# Altium schematic sheet Z_Power.SchDoc
size A3
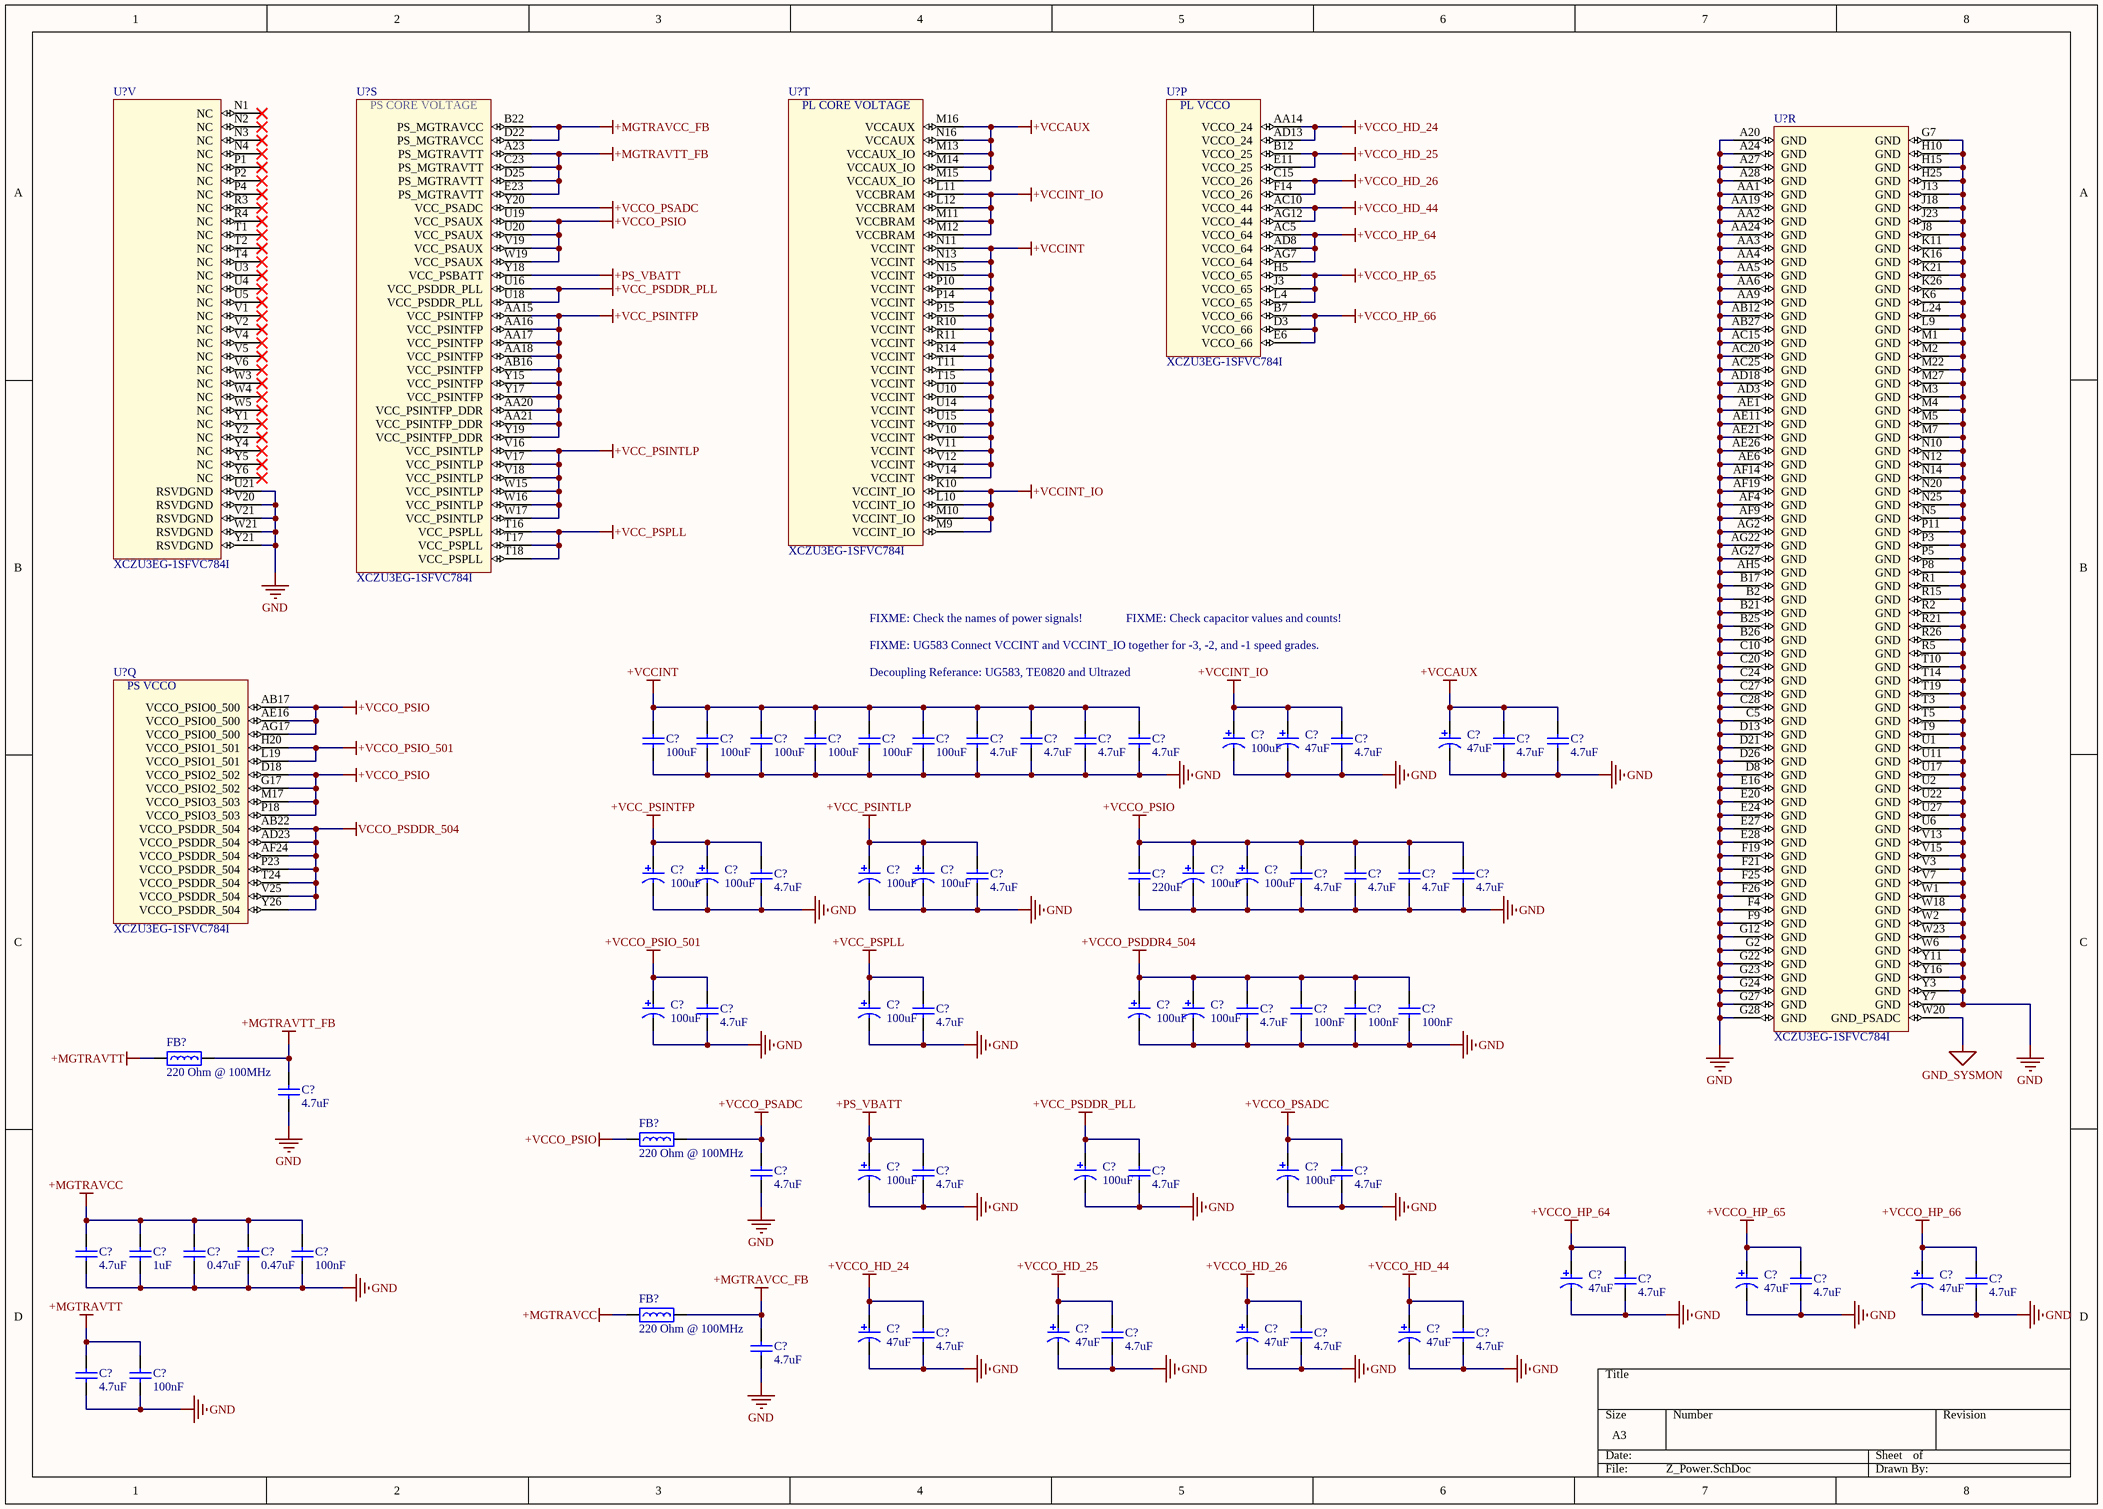
[diagram p0: Z_Power.SchDoc]

## Parts
(Parts that share a designator on the sheet are numbered #1, #2 ... from top to bottom, then left to right.)
C?#1  100uF  [AVX_TAN_F95_P_0905]
C?#2  47uF  [AVX_TAN_F38_M_0603]
C?#3  4.7uF  [CAPC1005L_0402]
C?#4  47uF  [AVX_TAN_F38_M_0603]
C?#5  4.7uF  [CAPC1005L_0402]
C?#6  4.7uF  [CAPC1005L_0402]
C?#7  100uF  [CAPC3225N_1210]
C?#8  100uF  [CAPC3225N_1210]
C?#9  100uF  [CAPC3225N_1210]
C?#10  100uF  [CAPC3225N_1210]
C?#11  100uF  [CAPC3225N_1210]
C?#12  100uF  [CAPC3225N_1210]
C?#13  4.7uF  [CAPC1005L_0402]
C?#14  4.7uF  [CAPC1005L_0402]
C?#15  4.7uF  [CAPC1005L_0402]
C?#16  4.7uF  [CAPC1005L_0402]
C?#17  100uF  [AVX_TAN_F95_P_0905]
C?#18  100uF  [AVX_TAN_F95_P_0905]
C?#19  4.7uF  [CAPC1005L_0402]
C?#20  100uF  [AVX_TAN_F95_P_0905]
C?#21  100uF  [AVX_TAN_F95_P_0905]
C?#22  4.7uF  [CAPC1005L_0402]
C?#23  100uF  [AVX_TAN_F95_P_0905]
C?#24  100uF  [AVX_TAN_F95_P_0905]
C?#25  4.7uF  [CAPC1005L_0402]
C?#26  4.7uF  [CAPC1005L_0402]
C?#27  4.7uF  [CAPC1005L_0402]
C?#28  4.7uF  [CAPC1005L_0402]
C?#29  220uF  [CAPC3225N_1210]
C?#30  100uF  [AVX_TAN_F95_P_0905]
C?#31  4.7uF  [CAPC1005L_0402]
C?#32  100uF  [AVX_TAN_F95_P_0905]
C?#33  4.7uF  [CAPC1005L_0402]
C?#34  100uF  [AVX_TAN_F95_P_0905]
C?#35  100uF  [AVX_TAN_F95_P_0905]
C?#36  4.7uF  [CAPC1005L_0402]
C?#37  100nF  [CAPC1005L_0402]
C?#38  100nF  [CAPC1005L_0402]
C?#39  100nF  [CAPC1005L_0402]
C?#40  4.7uF  [CAPC1005L_0402]
C?#41  4.7uF  [CAPC1005L_0402]
C?#42  100uF  [AVX_TAN_F95_P_0905]
C?#43  4.7uF  [CAPC1005L_0402]
C?#44  100uF  [AVX_TAN_F95_P_0905]
C?#45  4.7uF  [CAPC1005L_0402]
C?#46  100uF  [AVX_TAN_F95_P_0905]
C?#47  4.7uF  [CAPC1005L_0402]
C?#48  4.7uF  [CAPC1005L_0402]
C?#49  47uF  [AVX_TAN_F38_M_0603]
C?#50  4.7uF  [CAPC1005L_0402]
C?#51  47uF  [AVX_TAN_F38_M_0603]
C?#52  4.7uF  [CAPC1005L_0402]
C?#53  47uF  [AVX_TAN_F38_M_0603]
C?#54  4.7uF  [CAPC1005L_0402]
C?#55  1uF  [CAPC1005L_0402]
C?#56  0.47uF  [CAPC1005L_0402]
C?#57  0.47uF  [CAPC1005L_0402]
C?#58  100nF  [CAPC1005L_0402]
C?#59  47uF  [AVX_TAN_F38_M_0603]
C?#60  4.7uF  [CAPC1005L_0402]
C?#61  47uF  [AVX_TAN_F38_M_0603]
C?#62  4.7uF  [CAPC1005L_0402]
C?#63  47uF  [AVX_TAN_F38_M_0603]
C?#64  4.7uF  [CAPC1005L_0402]
C?#65  47uF  [AVX_TAN_F38_M_0603]
C?#66  4.7uF  [CAPC1005L_0402]
C?#67  4.7uF  [CAPC1005L_0402]
C?#68  4.7uF  [CAPC1005L_0402]
C?#69  100nF  [CAPC1005L_0402]
FB?#1  Impedance @ Frequency: 220 Ohm @ 100MHz  [INDC1608N_0603]
FB?#2  Impedance @ Frequency: 220 Ohm @ 100MHz  [INDC1608N_0603]
FB?#3  Impedance @ Frequency: 220 Ohm @ 100MHz  [INDC1608N_0603]
U?#1  XCZU3EG-1SFVC784I  [BGA784x28]  (part V of 22)
U?#2  XCZU3EG-1SFVC784I  [BGA784x28]  (part S of 22)
U?#3  XCZU3EG-1SFVC784I  [BGA784x28]  (part T of 22)
U?#4  XCZU3EG-1SFVC784I  [BGA784x28]  (part P of 22)
U?#5  XCZU3EG-1SFVC784I  [BGA784x28]  (part R of 22)
U?#6  XCZU3EG-1SFVC784I  [BGA784x28]  (part Q of 22)

## Nets
+MGTRAVCC: C?#48.1 C?#55.2 C?#56.2 C?#57.2 C?#58.2 FB?#3.1
+MGTRAVCC_FB: C?#67.1 FB?#3.2 U?#2.B22(PS_MGTRAVCC) U?#2.D22(PS_MGTRAVCC)
+MGTRAVTT: C?#68.1 C?#69.2 FB?#1.1
+MGTRAVTT_FB: C?#40.1 FB?#1.2 U?#2.A23(PS_MGTRAVTT) U?#2.C23(PS_MGTRAVTT) U?#2.D25(PS_MGTRAVTT) U?#2.E23(PS_MGTRAVTT)
+PS_VBATT: C?#42.1 C?#43.1 U?#2.Y18(VCC_PSBATT)
+VCC_PSDDR_PLL: C?#44.1 C?#45.1 U?#2.U16(VCC_PSDDR_PLL) U?#2.U18(VCC_PSDDR_PLL)
+VCC_PSINTFP: C?#17.1 C?#18.1 C?#19.1 U?#2.AA15(VCC_PSINTFP) U?#2.AA16(VCC_PSINTFP) U?#2.AA17(VCC_PSINTFP) U?#2.AA18(VCC_PSINTFP) U?#2.AA20(VCC_PSINTFP_DDR) U?#2.AA21(VCC_PSINTFP_DDR) U?#2.AB16(VCC_PSINTFP) U?#2.Y15(VCC_PSINTFP) U?#2.Y17(VCC_PSINTFP) U?#2.Y19(VCC_PSINTFP_DDR)
+VCC_PSINTLP: C?#20.1 C?#21.1 C?#22.1 U?#2.V16(VCC_PSINTLP) U?#2.V17(VCC_PSINTLP) U?#2.V18(VCC_PSINTLP) U?#2.W15(VCC_PSINTLP) U?#2.W16(VCC_PSINTLP) U?#2.W17(VCC_PSINTLP)
+VCC_PSPLL: C?#32.1 C?#33.1 U?#2.T16(VCC_PSPLL) U?#2.T17(VCC_PSPLL) U?#2.T18(VCC_PSPLL)
+VCCAUX: C?#4.1 C?#5.1 C?#6.1 U?#3.M13(VCCAUX_IO) U?#3.M14(VCCAUX_IO) U?#3.M15(VCCAUX_IO) U?#3.M16(VCCAUX) U?#3.N16(VCCAUX)
+VCCINT: C?#7.2 C?#8.2 C?#9.2 C?#10.2 C?#11.2 C?#12.2 C?#13.2 C?#14.2 C?#15.2 C?#16.2 U?#3.N11(VCCINT) U?#3.N13(VCCINT) U?#3.N15(VCCINT) U?#3.P10(VCCINT) U?#3.P14(VCCINT) U?#3.P15(VCCINT) U?#3.R10(VCCINT) U?#3.R11(VCCINT) U?#3.R14(VCCINT) U?#3.T11(VCCINT) U?#3.T15(VCCINT) U?#3.U10(VCCINT) U?#3.U14(VCCINT) U?#3.U15(VCCINT) U?#3.V10(VCCINT) U?#3.V11(VCCINT) U?#3.V12(VCCINT) U?#3.V14(VCCINT)
+VCCINT_IO: C?#1.1 C?#2.1 C?#3.1 U?#3.K10(VCCINT_IO) U?#3.L10(VCCINT_IO) U?#3.L11(VCCBRAM) U?#3.L12(VCCBRAM) U?#3.M9(VCCINT_IO) U?#3.M10(VCCINT_IO) U?#3.M11(VCCBRAM) U?#3.M12(VCCBRAM)
+VCCO_HD_24: C?#59.1 C?#60.1 U?#4.AA14(VCCO_24) U?#4.AD13(VCCO_24)
+VCCO_HD_25: C?#61.1 C?#62.1 U?#4.B12(VCCO_25) U?#4.E11(VCCO_25)
+VCCO_HD_26: C?#63.1 C?#64.1 U?#4.C15(VCCO_26) U?#4.F14(VCCO_26)
+VCCO_HD_44: C?#65.1 C?#66.1 U?#4.AC10(VCCO_44) U?#4.AG12(VCCO_44)
+VCCO_HP_64: C?#49.1 C?#50.1 U?#4.AC5(VCCO_64) U?#4.AD8(VCCO_64) U?#4.AG7(VCCO_64)
+VCCO_HP_65: C?#51.1 C?#52.1 U?#4.H5(VCCO_65) U?#4.J3(VCCO_65) U?#4.L4(VCCO_65)
+VCCO_HP_66: C?#53.1 C?#54.1 U?#4.B7(VCCO_66) U?#4.D3(VCCO_66) U?#4.E6(VCCO_66)
+VCCO_PSADC: C?#41.1 C?#46.1 C?#47.1 FB?#2.2 U?#2.Y20(VCC_PSADC)
+VCCO_PSDDR4_504: C?#34.1 C?#35.1 C?#36.1 C?#37.2 C?#38.2 C?#39.2
+VCCO_PSIO: C?#23.1 C?#24.1 C?#25.1 C?#26.1 C?#27.1 C?#28.1 C?#29.2 FB?#2.1 U?#2.U19(VCC_PSAUX) U?#2.U20(VCC_PSAUX) U?#2.V19(VCC_PSAUX) U?#2.W19(VCC_PSAUX) U?#6.AB17(VCCO_PSIO0_500) U?#6.AE16(VCCO_PSIO0_500) U?#6.AG17(VCCO_PSIO0_500) U?#6.D18(VCCO_PSIO2_502) U?#6.G17(VCCO_PSIO2_502) U?#6.M17(VCCO_PSIO3_503) U?#6.P18(VCCO_PSIO3_503)
+VCCO_PSIO_501: C?#30.1 C?#31.1 U?#6.H20(VCCO_PSIO1_501) U?#6.L19(VCCO_PSIO1_501)
GND: C?#1.2 C?#2.2 C?#3.2 C?#4.2 C?#5.2 C?#6.2 C?#7.1 C?#8.1 C?#9.1 C?#10.1 C?#11.1 C?#12.1 C?#13.1 C?#14.1 C?#15.1 C?#16.1 C?#17.2 C?#18.2 C?#19.2 C?#20.2 C?#21.2 C?#22.2 C?#23.2 C?#24.2 C?#25.2 C?#26.2 C?#27.2 C?#28.2 C?#29.1 C?#30.2 C?#31.2 C?#32.2 C?#33.2 C?#34.2 C?#35.2 C?#36.2 C?#37.1 C?#38.1 C?#39.1 C?#40.2 C?#41.2 C?#42.2 C?#43.2 C?#44.2 C?#45.2 C?#46.2 C?#47.2 C?#48.2 C?#49.2 C?#50.2 C?#51.2 C?#52.2 C?#53.2 C?#54.2 C?#55.1 C?#56.1 C?#57.1 C?#58.1 C?#59.2 C?#60.2 C?#61.2 C?#62.2 C?#63.2 C?#64.2 C?#65.2 C?#66.2 C?#67.2 C?#68.2 C?#69.1 U?#1.U21(RSVDGND) U?#1.V20(RSVDGND) U?#1.V21(RSVDGND) U?#1.W21(RSVDGND) U?#1.Y21(RSVDGND) U?#5.A20(GND) U?#5.A24(GND) U?#5.A27(GND) U?#5.A28(GND) U?#5.AA1(GND) U?#5.AA2(GND) U?#5.AA3(GND) U?#5.AA4(GND) U?#5.AA5(GND) U?#5.AA6(GND) U?#5.AA9(GND) U?#5.AA19(GND) U?#5.AA24(GND) U?#5.AB12(GND) U?#5.AB27(GND) U?#5.AC15(GND) U?#5.AC20(GND) U?#5.AC25(GND) U?#5.AD3(GND) U?#5.AD18(GND) U?#5.AE1(GND) U?#5.AE6(GND) U?#5.AE11(GND) U?#5.AE21(GND) U?#5.AE26(GND) U?#5.AF4(GND) U?#5.AF9(GND) U?#5.AF14(GND) U?#5.AF19(GND) U?#5.AG2(GND) U?#5.AG22(GND) U?#5.AG27(GND) U?#5.AH5(GND) U?#5.B2(GND) U?#5.B17(GND) U?#5.B21(GND) U?#5.B25(GND) U?#5.B26(GND) U?#5.C5(GND) U?#5.C10(GND) U?#5.C20(GND) U?#5.C24(GND) U?#5.C27(GND) U?#5.C28(GND) U?#5.D8(GND) U?#5.D13(GND) U?#5.D21(GND) U?#5.D26(GND) U?#5.E16(GND) U?#5.E20(GND) U?#5.E24(GND) U?#5.E27(GND) U?#5.E28(GND) U?#5.F4(GND) U?#5.F9(GND) U?#5.F19(GND) U?#5.F21(GND) U?#5.F25(GND) U?#5.F26(GND) U?#5.G2(GND) U?#5.G7(GND) U?#5.G12(GND) U?#5.G22(GND) U?#5.G23(GND) U?#5.G24(GND) U?#5.G27(GND) U?#5.G28(GND) U?#5.H10(GND) U?#5.H15(GND) U?#5.H25(GND) U?#5.J8(GND) U?#5.J13(GND) U?#5.J18(GND) U?#5.J23(GND) U?#5.K6(GND) U?#5.K11(GND) U?#5.K16(GND) U?#5.K21(GND) U?#5.K26(GND) U?#5.L9(GND) U?#5.L24(GND) U?#5.M1(GND) U?#5.M2(GND) U?#5.M3(GND) U?#5.M4(GND) U?#5.M5(GND) U?#5.M7(GND) U?#5.M22(GND) U?#5.M27(GND) U?#5.N5(GND) U?#5.N10(GND) U?#5.N12(GND) U?#5.N14(GND) U?#5.N20(GND) U?#5.N25(GND) U?#5.P3(GND) U?#5.P5(GND) U?#5.P8(GND) U?#5.P11(GND) U?#5.R1(GND) U?#5.R2(GND) U?#5.R5(GND) U?#5.R15(GND) U?#5.R21(GND) U?#5.R26(GND) U?#5.T3(GND) U?#5.T5(GND) U?#5.T9(GND) U?#5.T10(GND) U?#5.T14(GND) U?#5.T19(GND) U?#5.U1(GND) U?#5.U2(GND) U?#5.U6(GND) U?#5.U11(GND) U?#5.U17(GND) U?#5.U22(GND) U?#5.U27(GND) U?#5.V3(GND) U?#5.V7(GND) U?#5.V13(GND) U?#5.V15(GND) U?#5.W1(GND) U?#5.W2(GND) U?#5.W6(GND) U?#5.W18(GND) U?#5.W23(GND) U?#5.Y3(GND) U?#5.Y7(GND) U?#5.Y11(GND) U?#5.Y16(GND)
GND_SYSMON: U?#5.W20(GND_PSADC)
VCCO_PSDDR_504: U?#6.AB22(VCCO_PSDDR_504) U?#6.AD23(VCCO_PSDDR_504) U?#6.AF24(VCCO_PSDDR_504) U?#6.P23(VCCO_PSDDR_504) U?#6.T24(VCCO_PSDDR_504) U?#6.V25(VCCO_PSDDR_504) U?#6.Y26(VCCO_PSDDR_504)

Not connected (* = marked no-connect by the designer): U?#1 N1(NC)* N2(NC)* N3(NC)* N4(NC)* P1(NC)* P2(NC)* P4(NC)* R3(NC)* R4(NC)* T1(NC)* T2(NC)* T4(NC)* U3(NC)* U4(NC)* U5(NC)* V1(NC)* V2(NC)* V4(NC)* V5(NC)* V6(NC)* W3(NC)* W4(NC)* W5(NC)* Y1(NC)* Y2(NC)* Y4(NC)* Y5(NC)* Y6(NC)*

## Notes on the sheet
- FIXME: UG583 Connect VCCINT and VCCINT_IO together for -3, -2, and -1 speed grades.
- FIXME: Check the names of power signals!
- FIXME: Check capacitor values and counts!
- Decoupling Referance: UG583, TE0820 and Ultrazed
- (in symbol XCZU3EG-1SFVC784I, part P) PL VCCO
- (in symbol XCZU3EG-1SFVC784I, part Q) PS VCCO
- (in symbol XCZU3EG-1SFVC784I, part S) PS CORE VOLTAGE
- (in symbol XCZU3EG-1SFVC784I, part T) PL CORE VOLTAGE

## Library data of the parts
C?#1 C?#17 C?#18 C?#20 C?#21 C?#23 C?#24 C?#30 C?#32 C?#34 C?#35 C?#42 C?#44 C?#46 = CAPELE0905TAN100U6V3_20T: CAP TANT 100UF 6.3V 20% 0805; Manufacturer: AVX Corporation; Manufacturer Part Number: F950J107MPAAQ2; Temperature Coefficient: Tantalum; ESR: 1.2 Ohm; Package: 0905 P; ComponentLink1Description: Datasheet; ComponentLink1URL: C:\Users\Public\Documents\Altium\AD16\Library\PDF\F95.pdf; Value: 100uF; Voltage: 6.3V; Tolerance: 20%; Supplier 1: Digi-Key; Supplier Part Number 1: 478-8393-1-ND; Operating Temperature: -55°C ~ 125°C
C?#2 C?#4 C?#49 C?#51 C?#53 C?#59 C?#61 C?#63 C?#65 = CAPELE0603TAN47U6V3_20T: CAP TANT POLY 47UF 6.3V SMD; Manufacturer: AVX Corporation; Manufacturer Part Number: F380J476MMAAXE; Tolerance: 20%; Temperature Coefficient: Tantalum; ESR: 300 mOhm; Package: 0603 M; ComponentLink1Description: Datasheet; ComponentLink1URL: C:\Users\Public\Documents\Altium\AD16\Library\PDF\f38.pdf; Value: 47uF; Voltage: 6.3V; Supplier 1: Digi-Key; Supplier Part Number 1: 478-9399-1-ND; Operating Temperature: -55°C ~ 105°C
C?#3 C?#5 C?#6 C?#13-C?#16 C?#19 C?#22 C?#25-C?#28 C?#31 C?#33 C?#36 C?#40 C?#41 C?#43 C?#45 C?#47 C?#48 C?#50 C?#52 C?#54 C?#60 C?#62 C?#64 C?#66-C?#68 = CAPCER0402X5R4U710V_10T: CAP CER 4.7UF 10V X5R 0402; Manufacturer: TDK Corporation; Manufacturer Part Number: C1005X5R1A475K050BC; Tolerance: 10%; Package: 0402; ComponentLink1Description: Datasheet; Value: 4.7uF; Voltage: 10V; Temperature Coefficient: x5R; Supplier 1: Digi-Key; Supplier Part Number 1: 445-13820-1-ND; Operating Temperature: -55°C ~ 85°C
C?#7-C?#12 = CAPCER1210X5R100U16V_20T: CAP CER 100UF 16V X5R 1210; Manufacturer: Taiyo Yuden; Manufacturer Part Number: EMK325ABJ107MM-T; Tolerance: 20%; Package: 1210; ComponentLink1Description: Datasheet; Value: 100uF; Voltage: 16V; Temperature Coefficient: X5R; Supplier 1: Digi-Key; Supplier Part Number 1: 587-3152-1-ND; Operating Temperature: -55°C ~ 85°C
C?#29 = CAPCER1210X5R220U6V3_20T: CAP CER 220UF 6.3V X5R 1210; Manufacturer: Samsung Electro-Mechanics America, Inc.; Manufacturer Part Number: CL32A227MQVNNNE; Tolerance: 20%; Package: 1210; ComponentLink1Description: Datasheet; Value: 220uF; Voltage: 6.3V; Temperature Coefficient: X5R; Supplier 1: Digi-Key; Supplier Part Number 1: 1276-3375-1-ND; Operating Temperature: -55°C ~ 85°C
C?#37-C?#39 C?#58 C?#69 = CAPCER0402X7R100N25V_10T: CAP CER 0.1UF 25V X7R 0402; Manufacturer: Murata Electronics North America; Manufacturer Part Number: GRM155R71E104KE14D; Tolerance: 10%; Package: 0402; ComponentLink1Description: Datasheet; Value: 100nF; Voltage: 25V; Temperature Coefficient: X7R; Supplier 1: Digi-Key; Supplier Part Number 1: 490-10698-1-ND; Operating Temperature: -55°C ~ 125°C
C?#55 = CAPCER0402X5R1U16V_20T: CAP CER 1UF 16V X5R 0402; Manufacturer: Murata Electronics North America; Manufacturer Part Number: GRM155R61C105ME01D; Tolerance: 20%; Package: 0402; ComponentLink1Description: Datasheet; Value: 1uF; Voltage: 16V; Temperature Coefficient: X5R; Supplier 1: Digi-Key; Supplier Part Number 1: 490-10454-1-ND; Operating Temperature: -55°C ~ 85°C
C?#56 C?#57 = CAPCER0402X5R0U4710V_10T: CAP CER 0.47UF 10V X5R 0402; Manufacturer: Murata Electronics North America; Manufacturer Part Number: GRM155R61A474KE15D; Tolerance: 10%; Package: 0402; ComponentLink1Description: Datasheet; Value: 0.47uF; Voltage: 10V; Temperature Coefficient: X5R; Supplier 1: Digi-Key; Supplier Part Number 1: 490-3264-1-ND; Operating Temperature: -55°C ~ 85°C
FB?#1-FB?#3 = BEAD0603_220_2A5_40M: FERRITE BEAD 220 OHM 0603 1LN; Manufacturer: Murata Electronics North America; Manufacturer Part Number: BLM18SG221TN1D; Current Rating (Max): 2.5A; DC Resistance (DCR) (Max): 40 mohm; Package: 0603; ComponentLink1Description: Datasheet; ComponentLink1URL: C:\Users\Public\Documents\Altium\AD16\Library\PDF\ENFA0003.pdf; Supplier 1: Digi-Key; Supplier Part Number 1: 490-5225-1-ND; Operating Temperature: -55°C ~ 125°C
U?#1-U?#6 = XCZU3EG-1SFVC784I: IC FPGA 252 I/O 784FCBGA - XILINX ZYNQ ULTRASCALE+; Manufacturer: Xilinx Inc.; Package: SFVC784; ComponentLink1Description: Datasheet; Supplier 1: Digi-Key; Supplier Part Number 1: XCZU3EG-1SFVC784I-ND; Manufacturer Part Number: XCZU3EG-1SFVC784I